# EAGLE schematic homenodeInline (EAGLE 6.4)
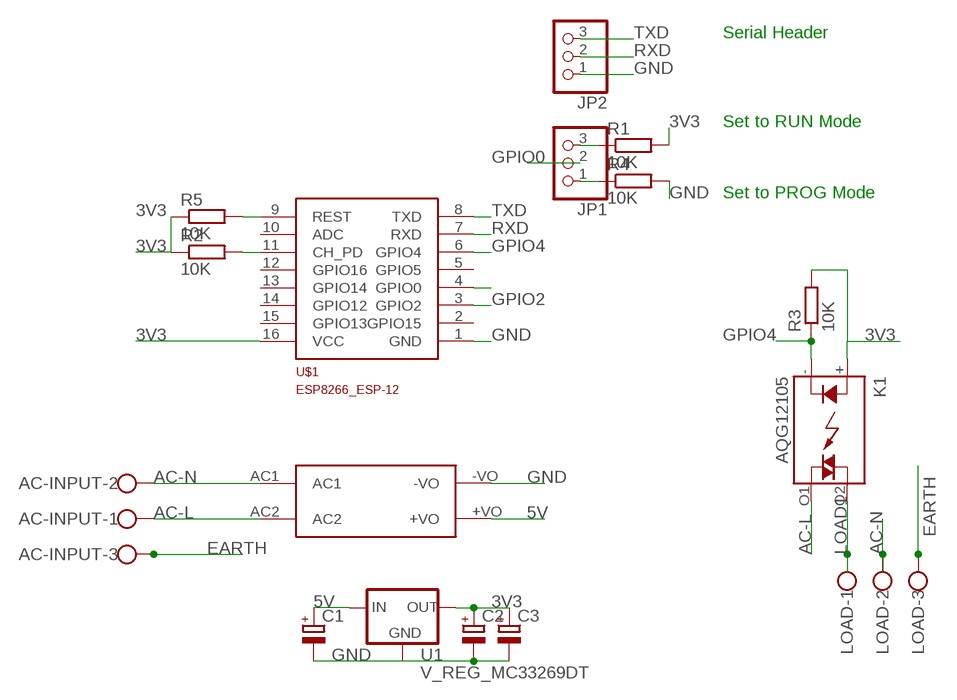
[diagram p0: schematic, sheet 1]

## Parts
AC-INPUT  W237-103  [W237-103]
C1  CPOL-EUC  [PANASONIC_C]
C2  CPOL-EUC  [PANASONIC_C]
C3  CPOL-EUC  [PANASONIC_C]
JP1  PINHD-1X3  [1X03]
JP2  PINHD-1X3  [1X03]
K1  AQG12105  [AQG]
LOAD  W237-103  [W237-103]
R1  10K  R-EU_M1206  [M1206]
R2  10K  R-EU_M1206  [M1206]
R3  10K  R-EU_M1206  [M1206]
R4  10K  R-EU_M1206  [M1206]
R5  10K  R-EU_M1206  [M1206]
U1  V_REG_MC33269DT  [DPAK]
U$1  ESP8266_ESP-12  [ESP8266-ESP12]
U$4  HLK-PM01  [HLK-PM01]

## Nets
3V3: C2.+ C3.+ K1.+(A) R1.2 R2.1 R3.2 R5.1 U1.4(OUT) U$1.16(VCC)
5V: C1.+ U1.3(IN) U$4.+VO
AC-L: AC-INPUT.1 K1.O1(DS2) U$4.AC2
AC-N: AC-INPUT.2 LOAD.2 U$4.AC1
CH_PD: R2.2 U$1.11(CH_PD)
EARTH: AC-INPUT.3 LOAD.3
GND: C1.- C2.- C3.- JP2.1 R4.2 U1.1(GND) U$1.1(GND) U$4.-VO
GPIO0: JP1.2 U$1.4(GPIO0)
GPIO2: U$1.3(GPIO2)
GPIO4: K1.-(K) R3.1 U$1.6(GPIO4)
LOAD1: K1.O2(DS1) LOAD.1
N$1: JP1.3 R1.1
N$3: JP1.1 R4.1
N$4: R5.2 U$1.9(REST)
RXD: JP2.2 U$1.7(RXD)
TXD: JP2.3 U$1.8(TXD)
Unconnected: U$1.2(GPIO15) U$1.5(GPIO5) U$1.10(ADC) U$1.12(GPIO16) U$1.13(GPIO14) U$1.14(GPIO12) U$1.15(GPIO13)

## Notes on the sheet
- Serial Header
- Set to RUN Mode
- Set to PROG Mode

## Library data of the parts
AC-INPUT LOAD = con-wago-500:W237-103: WAGO SCREW CLAMP; MPN: 237-103; OC_FARNELL: unknown; OC_NEWARK: 18M7116
C1-C3 = resistor:CPOL-EU: POLARIZED CAPACITOR, European symbol
JP1 JP2 = pinhead:PINHD-1X3: PIN HEADER
K1 = relay:AQG*: SOLID STATE RELAY NAiS Zero-cross, Non zero-cross Source: http://www.mew-europe.com/.. en_ds_61611_0000.pdf; MF: AROMAT/ MATSUSHITA; MPN: AQG12105; OC_FARNELL: unknown; OC_NEWARK: 20J4759
R1-R5 = resistor:R-EU_: RESISTOR, European symbol
U1 = SparkFun-PowerIC:V_REG_MC33269
U$1 = ESP8266-ESP12:ESP8266_ESP-12: ESP8266 ESP-12 Discussion about pins here: http://www.esp8266.com/viewtopic.php?f=13&t=1429
U$4 = hlk-pm01:HLK-PM01